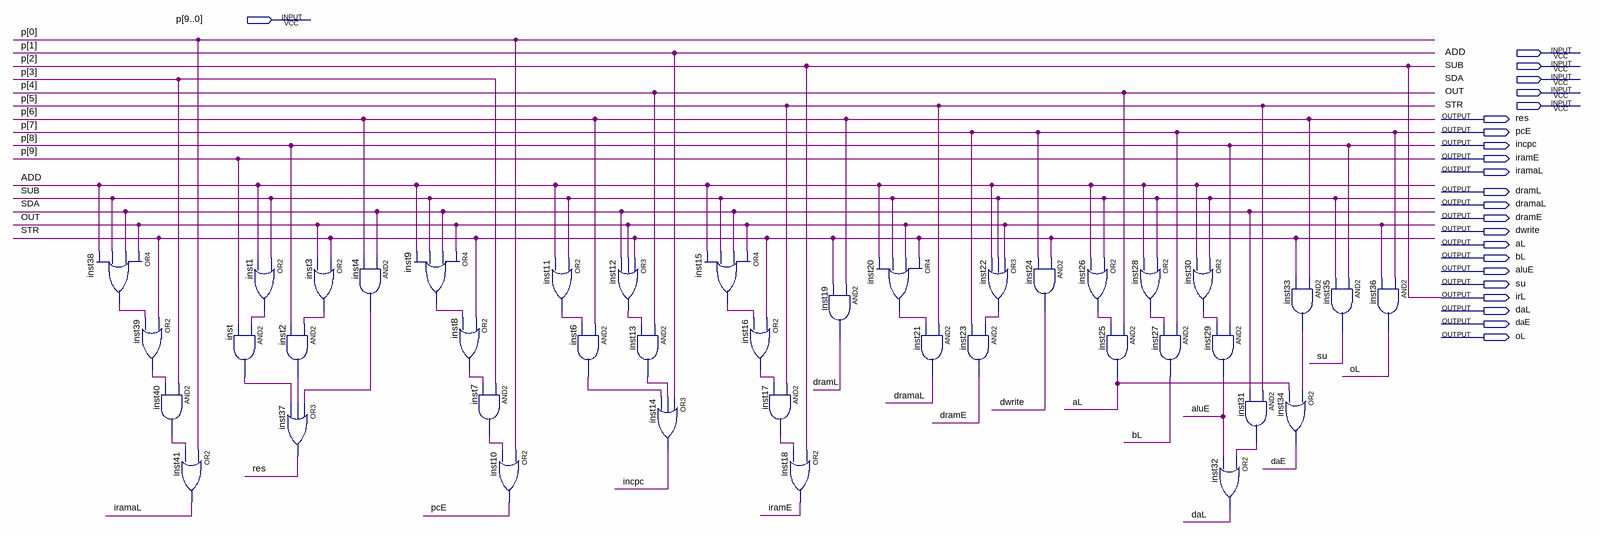
[diagram p0: schematic sheet]
// Quartus schematic control.bdf as structural Verilog: 41 symbols, 23 pins
module control (
  input  [9:0] p,
  input  ADD,
  input  SUB,
  input  SDA,
  input  OUT,
  input  STR,
  output res,
  output pcE,
  output incpc,
  output iramE,
  output iramaL,
  output dramL,
  output dramaL,
  output dramE,
  output dwrite,
  output aL,
  output bL,
  output aluE,
  output su,
  output irL,
  output daL,
  output daE,
  output oL
);

  wire inst1_out, inst2_out, inst3_out, inst4_out, inst6_out, inst7_out, inst8_out, inst9_out, inst11_out,
       inst12_out, inst13_out, inst15_out, inst16_out, inst17_out, inst20_out, inst22_out, inst26_out,
       inst28_out, inst30_out, inst31_out, inst33_out, inst38_out, inst39_out, inst40_out, inst_out;

  or inst38 (inst38_out, OUT, SDA, SUB, ADD);
  or inst39 (inst39_out, STR, inst38_out);
  and inst40 (inst40_out, p[3], inst39_out);
  or inst41 (iramaL, p[0], inst40_out);
  or inst1 (inst1_out, SUB, ADD);
  and inst (inst_out, inst1_out, p[9]);
  or inst3 (inst3_out, STR, OUT);
  and inst2 (inst2_out, inst3_out, p[8]);
  or inst37 (res, inst4_out, inst2_out, inst_out);
  and inst4 (inst4_out, SDA, p[6]);
  or inst9 (inst9_out, OUT, SDA, SUB, ADD);
  or inst8 (inst8_out, STR, inst9_out);
  and inst7 (inst7_out, p[3], inst8_out);
  or inst10 (pcE, p[0], inst7_out);
  or inst11 (inst11_out, SUB, ADD);
  and inst6 (inst6_out, p[6], inst11_out);
  or inst12 (inst12_out, STR, OUT, SDA);
  and inst13 (inst13_out, p[4], inst12_out);
  or inst14 (incpc, p[1], inst13_out, inst6_out);
  or inst15 (inst15_out, OUT, SDA, SUB, ADD);
  or inst16 (inst16_out, STR, inst15_out);
  and inst17 (inst17_out, p[5], inst16_out);
  or inst18 (iramE, p[2], inst17_out);
  and inst19 (dramL, p[6], STR);
  or inst20 (inst20_out, STR, OUT, SUB, ADD);
  and inst21 (dramaL, p[5], inst20_out);
  or inst22 (inst22_out, OUT, SUB, ADD);
  and inst23 (dramE, inst22_out, p[7]);
  and inst24 (dwrite, STR, p[7]);
  or inst26 (inst26_out, SUB, ADD);
  and inst25 (aL, p[4], inst26_out);
  or inst28 (inst28_out, SUB, ADD);
  and inst27 (bL, p[7], inst28_out);
  or inst30 (inst30_out, SUB, ADD);
  and inst29 (aluE, p[8], inst30_out);
  or inst32 (daL, inst31_out, aluE);
  and inst31 (inst31_out, p[5], SDA);
  and inst33 (inst33_out, p[6], STR);
  and inst35 (su, p[8], SUB);
  or inst34 (daE, inst33_out, aL);
  and inst36 (oL, p[7], OUT);

  assign irL = p[2];
endmodule
